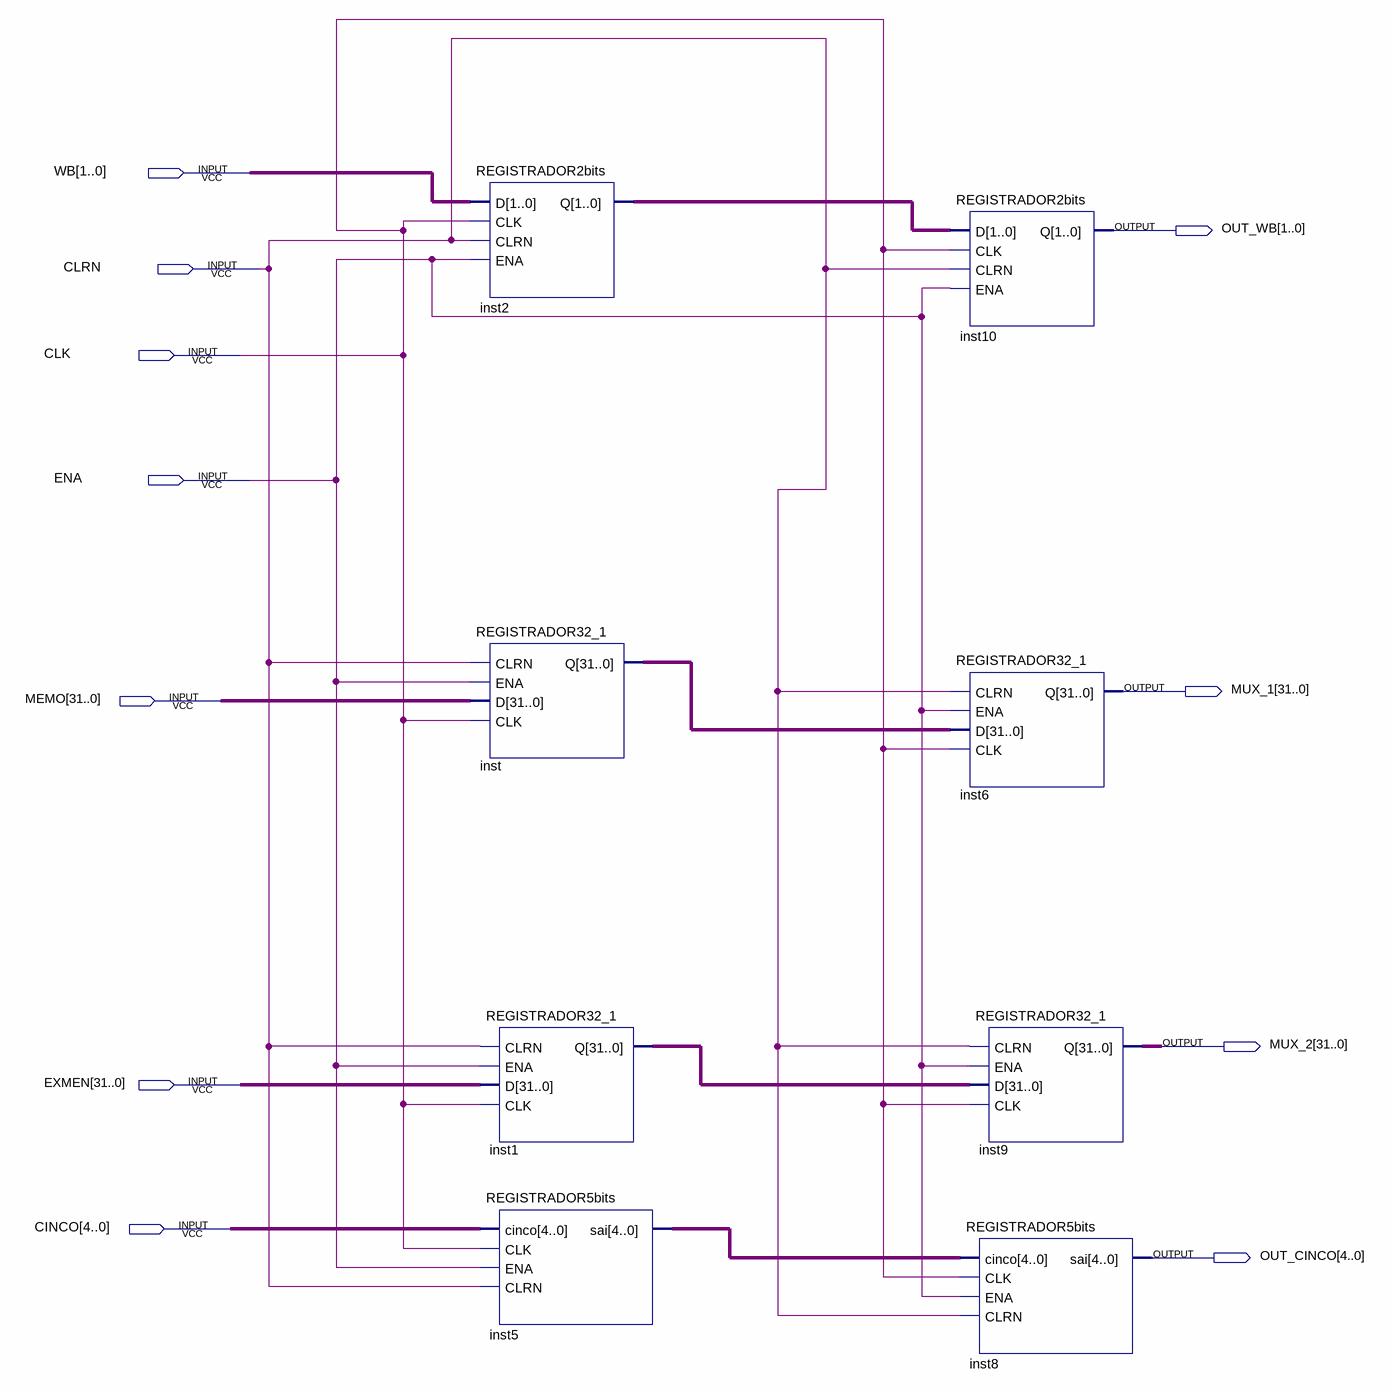
[diagram p0: schematic sheet]
// Quartus schematic MEN_WB.bdf as structural Verilog: 8 symbols, 11 pins
module MEN_WB (
  input  [1:0] WB,
  input  CLRN,
  input  CLK,
  input  ENA,
  input  [31:0] MEMO,
  input  [31:0] EXMEN,
  input  [4:0] CINCO,
  output [1:0] OUT_WB,
  output [31:0] MUX_1,
  output [31:0] MUX_2,
  output [4:0] OUT_CINCO
);

  wire [1:0] inst2_q;
  wire [4:0] inst5_sai;
  wire [31:0] inst1_q, inst_q;

  REGISTRADOR2bits inst2 (.D(WB), .CLK(CLK), .CLRN(CLRN), .ENA(ENA), .Q(inst2_q));
  REGISTRADOR32_1 inst (.CLRN(CLRN), .ENA(ENA), .D(MEMO), .CLK(CLK), .Q(inst_q));
  REGISTRADOR32_1 inst1 (.CLRN(CLRN), .ENA(ENA), .D(EXMEN), .CLK(CLK), .Q(inst1_q));
  REGISTRADOR5bits inst5 (.cinco(CINCO), .CLK(CLK), .ENA(ENA), .CLRN(CLRN), .sai(inst5_sai));
  REGISTRADOR2bits inst10 (.D(inst2_q), .CLK(CLK), .CLRN(CLRN), .ENA(ENA), .Q(OUT_WB));
  REGISTRADOR32_1 inst6 (.CLRN(CLRN), .ENA(ENA), .D(inst_q), .CLK(CLK), .Q(MUX_1));
  REGISTRADOR32_1 inst9 (.CLRN(CLRN), .ENA(ENA), .D(inst1_q), .CLK(CLK), .Q(MUX_2));
  REGISTRADOR5bits inst8 (.cinco(inst5_sai), .CLK(CLK), .ENA(ENA), .CLRN(CLRN), .sai(OUT_CINCO));
endmodule
